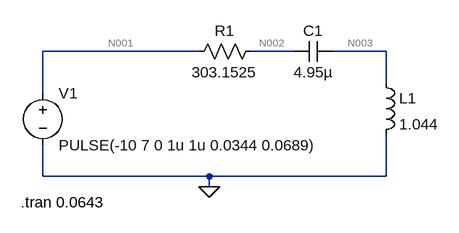
[diagram p0: schematic Draft4.asc]
Draft4.asc, the LTspice schematic file:
Version 4
SHEET 1 880 680
WIRE 496 144 256 144
WIRE 640 144 576 144
WIRE 784 144 704 144
WIRE 784 192 784 144
WIRE 256 208 256 144
WIRE 256 336 256 288
WIRE 512 336 256 336
WIRE 784 336 784 272
WIRE 784 336 512 336
WIRE 512 352 512 336
FLAG 512 352 0
SYMBOL voltage 256 192 R0
WINDOW 123 0 0 Left 0
WINDOW 39 0 0 Left 0
SYMATTR InstName V1
SYMATTR Value PULSE(-10 7 0 1u 1u 0.0344 0.0689)
SYMBOL ind 768 176 R0
SYMATTR InstName L1
SYMATTR Value 1.044
SYMATTR SpiceLine Rser=26
SYMBOL res 480 160 R270
WINDOW 0 32 56 VTop 2
WINDOW 3 0 56 VBottom 2
SYMATTR InstName R1
SYMATTR Value 303.1525
SYMBOL cap 704 128 R90
WINDOW 0 0 32 VBottom 2
WINDOW 3 32 32 VTop 2
SYMATTR InstName C1
SYMATTR Value 4.95µ
TEXT 222 376 Left 2 !.tran 0.0643

The netlist it stands for:
* Draft4.asc
V1 N001 0 PULSE(-10 7 0 1u 1u 0.0344 0.0689)
L1 N003 0 1.044 Rser=26
R1 N001 N002 303.1525
C1 N003 N002 4.95µ
.tran 0.0643
.backanno
.end

* Results of the author's LTspice run, read from the files saved beside the schematic
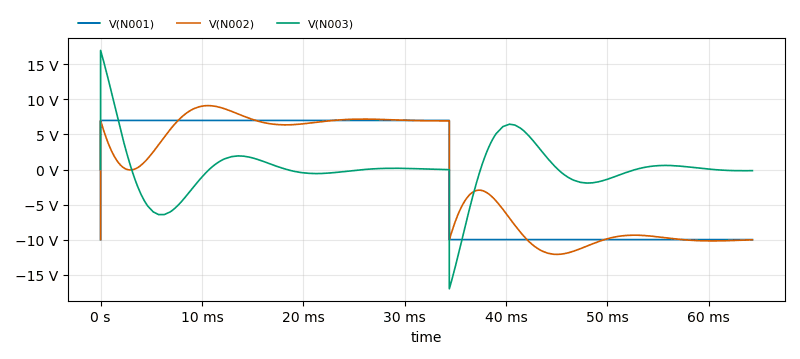
[diagram p1: Transient Analysis of Draft4.asc, plotted from the saved traces]
* Transient Analysis, 1 run:
*   V(N001): min -10 V, max 7 V, average -904.9 mV, rms 8.527 V, last -10 V
*   V(N002): min -12.11 V, max 9.116 V, average -908 mV, rms 8.095 V, last -10.03 V
*   V(N003): min -17.02 V, max 17 V, average 1.39 mV, rms 3.782 V, last -160.4 mV